# Altium schematic sheet rtd_interface_MAX31865.SchDoc: RTD interface
size A4; PageSetup: Record=PageOptions|CenterHorizontal=True|CenterVertical=True|PrintScale=1.00|XCorrection=1.00|YCorrection=1.00|PrintKind=0|BorderSize=5000000|LeftOffset=0|BottomOffset=0|Orientation=2|PaperLength=1000|PaperWidth=1000|Scale=100|PaperSource=7|PrintQuality=-3|MediaType=1|DitherType=10|PrintScaleMode=1|PaperKind=A4|PaperIndex=9
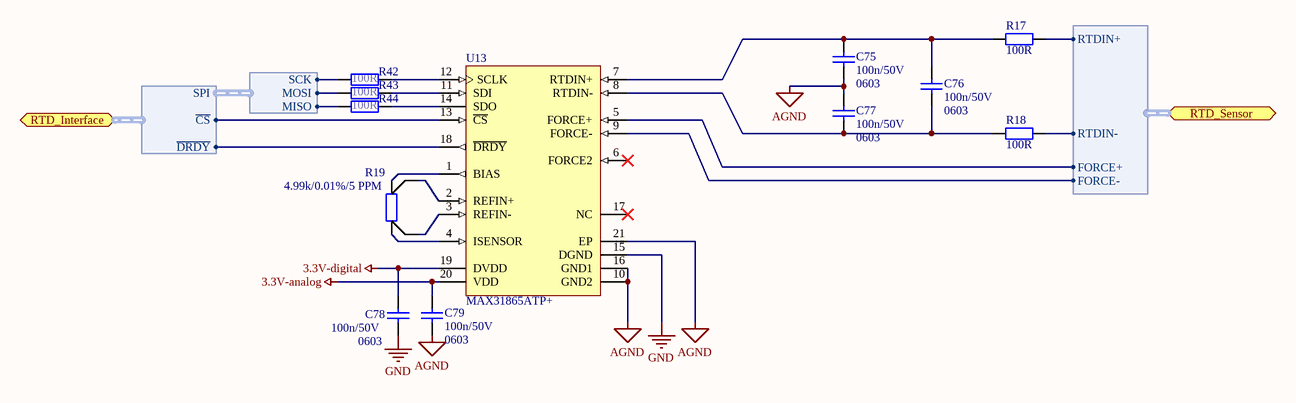
[diagram p0: rtd_interface_MAX31865.SchDoc]

## Parts
C75  Package: 0603  [SMD_Capacitor_0603]  (hidden comment: 100n/50V)
C76  Package: 0603  [SMD_Capacitor_0603]  (hidden comment: 100n/50V)
C77  Package: 0603  [SMD_Capacitor_0603]  (hidden comment: 100n/50V)
C78  Package: 0603  [SMD_Capacitor_0603]  (hidden comment: 100n/50V)
C79  Package: 0603  [SMD_Capacitor_0603]  (hidden comment: 100n/50V)
R17  100R  [0603]
R18  100R  [0603]
R19  4.99k/0.01%/5 PPM  [0603_shunt]
R42  100R  [0603]
R43  100R  [0603]
R44  100R  [0603]
U13  MAX31865ATP+  [MAXM-T2055+5_M]

## Ports
RTD_Interface (harness RTD_DIGITAL), RTD_Sensor (harness RTD_SENSOR)

## Harnesses
SPI: SCK, MOSI, MISO
RTD_DIGITAL: SPI, ~{CS}, ~{DRDY}
RTD_SENSOR: RTDIN+, RTDIN-, FORCE+, FORCE-

## Nets
3.3V-analog: C79.1 U13.20(VDD)
3.3V-digital: C78.1 U13.19(DVDD)
AGND: C75.1 C77.2 C79.2 U13.10(GND2) U13.16(GND1) U13.21(EP)
GND: C78.2 U13.15(DGND)
NetC75_2: C75.2 C76.2 R17.1 U13.7(RTDIN+)
NetC76_1: C76.1 C77.1 R18.1 U13.8(RTDIN-)
NetR17_2: R17.2 ; port RTD_Sensor.RTDIN+
NetR18_2: R18.2 ; port RTD_Sensor.RTDIN-
NetR19_1: R19.1 U13.1(BIAS)
NetR19_2: R19.2 U13.2(REFIN+)
NetR19_3: R19.3 U13.3(REFIN-)
NetR19_4: R19.4 U13.4(ISENSOR)
NetR42_1: R42.1 ; harness SPI.SCK
NetR42_2: R42.2 U13.12(SCLK)
NetR43_1: R43.1 ; harness SPI.MOSI
NetR43_2: R43.2 U13.11(SDI)
NetR44_1: R44.1 ; harness SPI.MISO
NetR44_2: R44.2 U13.14(SDO)
NetU13_5: U13.5(FORCE+) ; port RTD_Sensor.FORCE+
NetU13_9: U13.9(FORCE-) ; port RTD_Sensor.FORCE-
NetU13_13: U13.13(~{CS}) ; port RTD_Interface.~{CS}
NetU13_18: U13.18(~{DRDY}) ; port RTD_Interface.~{DRDY}

Not connected (* = marked no-connect by the designer): U13 6(FORCE2)* 17(NC)*

## Notes on the sheet
- Title:
- Sheet:
- of
- Author:
- Model:
- Document Number:
- Checked by:
- Iss-Rev:
- Approved by:
- Date:
- File name:

## Library data of the parts
C75-C79 = Cer_C0603T104K5RALTU: Ceramic Cap Kemet COTS 100n/50V X7R 0603; Manufacturer: Kemet; ManufacturerPartNumber: C0603T104K5RALTU; Value: 100n/50V
R17 R18 R42-R44 = Res: Generic resistor; value: 100R
R19 = Res_Shunt: Generic shunt resistor; value: 4.99k/0.01%/5 PPM
U13 = MAX31865ATP+: RTD-to-Digital Converter, 15 Bits Temperature Resolution, -40 to 125 degC, 20-Pin QFN (T2055+5), Pb-Free; Interface: SPI; Parasite Pwr.: No; DatasheetVersion: Rev. 0; PackageVersion: Rev. Q, 09/2011; PackageReference: T2055+5; PackageDescription: 20-Pin Thin Quad Flatpack, No Leads, Body 5 x 5 mm, Pitch 0.65 mm; Supplier 1: Digi-Key; Supplier Part Number 1: MAX31865ATP+-ND; Supplier 2: Mouser; Supplier Part Number 2: 700-MAX31865ATP+; Functions: RTD-to-Digital Converter; Generic Part Number: MAX31865; Mounting Technology: Surface Mount; Code_JEDEC: MO-220; PartNumber: MAX31865ATP+; ComponentLink1Description: Manufacturer URL; ComponentLink1URL: http://www.maximintegrated.com/; ComponentLink2Description: Datasheet; ComponentLink2URL: http://datasheets.maximintegrated.com/en/ds/MAX31865.pdf; ComponentLink3Description: Package Specification; ComponentLink3URL: http://pdfserv.maximintegrated.com/package_dwgs/21-0140.PDF